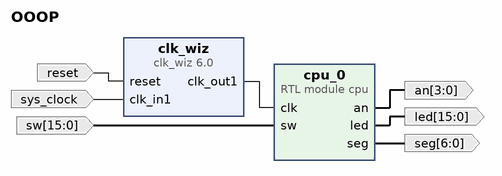
[diagram p0: block diagram of the top level]
# Vivado block design OOOP, xc7a35tcpg236-1, Vivado 2023.1
create_bd_design OOOP

create_bd_port -dir I -type clk sys_clock
set_property -dict {CONFIG.FREQ_HZ 100000000 CONFIG.PHASE 0.0} [get_bd_ports sys_clock]
create_bd_port -dir I -type rst reset
set_property -dict {CONFIG.POLARITY ACTIVE_HIGH} [get_bd_ports reset]
create_bd_port -dir O -from 6 -to 0 seg
create_bd_port -dir O -from 3 -to 0 an
create_bd_port -dir I -from 15 -to 0 sw
create_bd_port -dir O -from 15 -to 0 led

create_bd_cell -type ip -vlnv xilinx.com:ip:clk_wiz:6.0 clk_wiz
set_property -dict [list \
  CONFIG.CLK_IN1_BOARD_INTERFACE sys_clock \
  CONFIG.RESET_BOARD_INTERFACE reset \
  CONFIG.USE_BOARD_FLOW true \
] [get_bd_cells clk_wiz]
create_bd_cell -type module -reference cpu cpu_0

# ---- connections ----

connect_bd_net [get_bd_pins clk_wiz/clk_out1] [get_bd_pins cpu_0/clk]
connect_bd_net [get_bd_pins cpu_0/an] [get_bd_ports an]
connect_bd_net [get_bd_pins cpu_0/led] [get_bd_ports led]
connect_bd_net [get_bd_pins cpu_0/seg] [get_bd_ports seg]
connect_bd_net [get_bd_ports reset] [get_bd_pins clk_wiz/reset]
connect_bd_net -net sw_0_1 [get_bd_ports sw] [get_bd_pins cpu_0/sw]
connect_bd_net [get_bd_ports sys_clock] [get_bd_pins clk_wiz/clk_in1]

validate_bd_design
save_bd_design
